# Altium schematic sheet Connectors.SchDoc
size A4; SheetNumber: 4; SheetTotal: 7
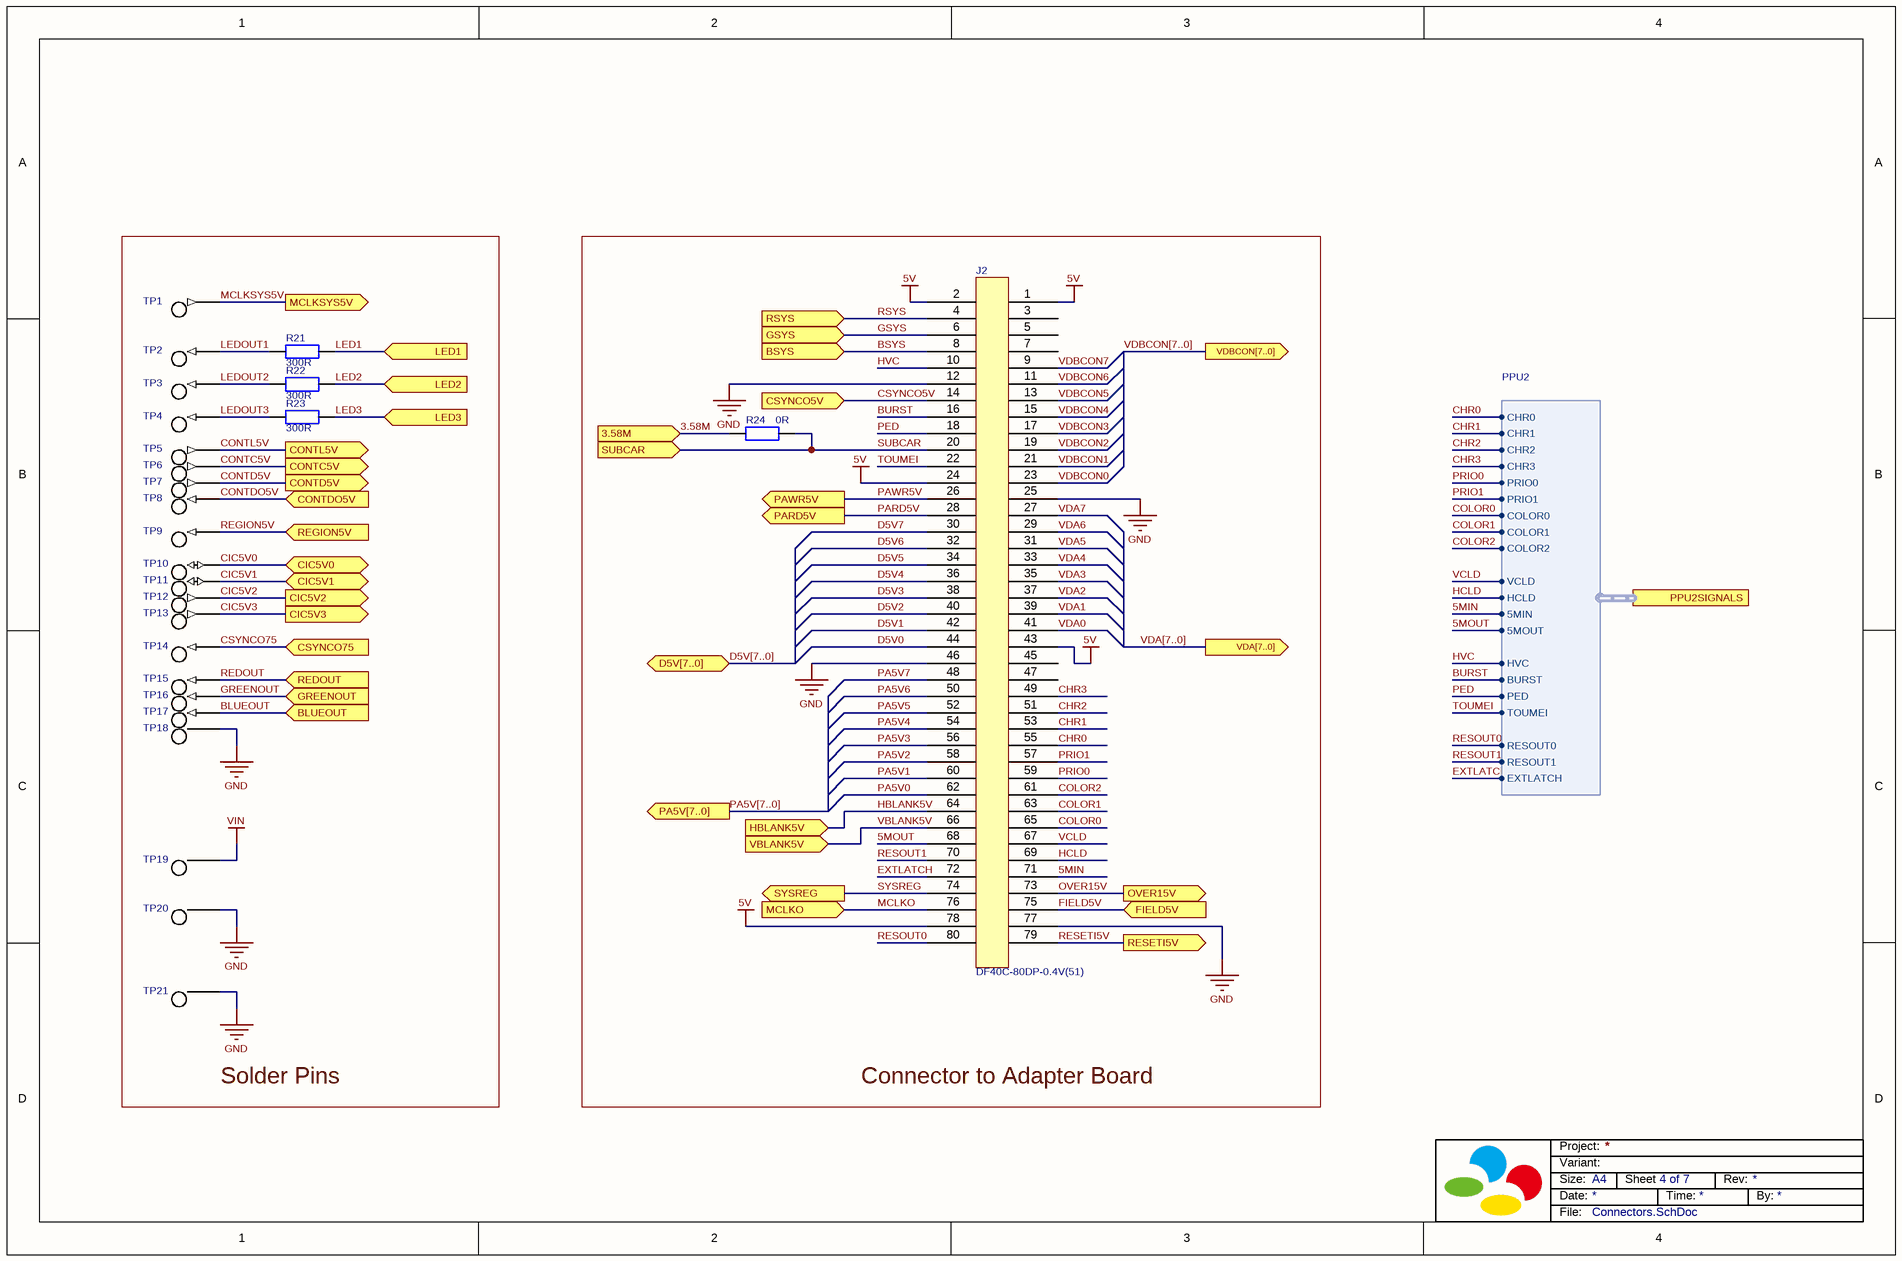
[diagram p0: Connectors.SchDoc]

## Parts
J2  Manufacturer_Part_Number: DF40C-80DP-0.4V(51)  [DF40C-80DP]  (hidden comment: DF40C-80DP)
R21  value 300R  [Res_0603_Chip]  (hidden comment: Resistor 300R 0603 ±1%)
R22  value 300R  [Res_0603_Chip]  (hidden comment: Resistor 300R 0603 ±1%)
R23  value 300R  [Res_0603_Chip]  (hidden comment: Resistor 300R 0603 ±1%)
R24  value 0R  [Res_0603_Chip]  (hidden comment: Resistor 0R 0603 ±1%)
TP1  Pin Connector  [Pin Connector Small]  (value not drawn)  (no BOM)
TP2  Pin Connector  [Pin Connector Small]  (value not drawn)  (no BOM)
TP3  Pin Connector  [Pin Connector Small]  (value not drawn)  (no BOM)
TP4  Pin Connector  [Pin Connector Small]  (value not drawn)  (no BOM)
TP5  Pin Connector  [Pin Connector Small]  (value not drawn)  (no BOM)
TP6  Pin Connector  [Pin Connector Small]  (value not drawn)  (no BOM)
TP7  Pin Connector  [Pin Connector Small]  (value not drawn)  (no BOM)
TP8  Pin Connector  [Pin Connector Small]  (value not drawn)  (no BOM)
TP9  Pin Connector  [Pin Connector Small]  (value not drawn)  (no BOM)
TP10  Pin Connector  [Pin Connector Small]  (value not drawn)  (no BOM)
TP11  Pin Connector  [Pin Connector Small]  (value not drawn)  (no BOM)
TP12  Pin Connector  [Pin Connector Small]  (value not drawn)  (no BOM)
TP13  Pin Connector  [Pin Connector Small]  (value not drawn)  (no BOM)
TP14  Pin Connector  [Pin Connector Small]  (value not drawn)  (no BOM)
TP15  Pin Connector  [Pin Connector Small]  (value not drawn)  (no BOM)
TP16  Pin Connector  [Pin Connector Small]  (value not drawn)  (no BOM)
TP17  Pin Connector  [Pin Connector Small]  (value not drawn)  (no BOM)
TP18  Pin Connector  [Pin Connector Small]  (value not drawn)  (no BOM)
TP19  Pin Connector  [Pin Connector Small]  (value not drawn)  (no BOM)
TP20  Pin Connector  [Pin Connector Small]  (value not drawn)  (no BOM)
TP21  Pin Connector  [Pin Connector Small]  (value not drawn)  (no BOM)

## Blocks framed on the sheet
Solder Pins: R21-R23 TP1-TP21
Connector to Adapter Board: J2 R24

## Ports
3.58M (in), BLUEOUT (in), BSYS (in), CIC5V0 (bidir), CIC5V1 (bidir), CIC5V2 (out), CIC5V3 (out), CONTC5V (out), CONTD5V (out), CONTDO5V (in), CONTL5V (out), CSYNCO5V (in), CSYNCO75 (in), D5V[7..0] (bidir), FIELD5V (in), GREENOUT (in), GSYS (in), HBLANK5V (in), LED1 (in), LED2 (in), LED3 (in), MCLKO (in), MCLKSYS5V (out), OVER15V (out), PA5V[7..0] (out), PARD5V (out), PAWR5V (out), PPU2SIGNALS (harness PPU2), REDOUT (in), REGION5V (in), RESETI5V (out), RSYS (in), SUBCAR (in), SYSREG (out), VBLANK5V (in), VDA[7..0] (out), VDBCON[7..0] (out)

## Harnesses
PPU2: CHR0, CHR1, CHR2, CHR3, PRIO0, PRIO1, COLOR0, COLOR1, COLOR2, VCLD, HCLD, 5MIN, 5MOUT, HVC, BURST, PED, TOUMEI, RESOUT0, RESOUT1, EXTLATCH

## Nets
5V: J2.1 J2.2 J2.24 J2.43 J2.78
GND: J2.12 J2.25 J2.46 J2.77 TP18.1 TP20.1 TP21.1
VIN: TP19.1
3.58M: R24.2 ; port 3.58M
5MIN: J2.71 ; port PPU2SIGNALS.5MIN
5MOUT: J2.68 ; port PPU2SIGNALS.5MOUT
BLUEOUT: TP17.1 ; port BLUEOUT
BSYS: J2.8 ; port BSYS
BURST: J2.16 ; port PPU2SIGNALS.BURST
CHR0: J2.55 ; port PPU2SIGNALS.CHR0
CHR1: J2.53 ; port PPU2SIGNALS.CHR1
CHR2: J2.51 ; port PPU2SIGNALS.CHR2
CHR3: J2.49 ; port PPU2SIGNALS.CHR3
CIC5V0: TP10.1 ; port CIC5V0
CIC5V1: TP11.1 ; port CIC5V1
CIC5V2: TP12.1 ; port CIC5V2
CIC5V3: TP13.1 ; port CIC5V3
COLOR0: J2.65 ; port PPU2SIGNALS.COLOR0
COLOR1: J2.63 ; port PPU2SIGNALS.COLOR1
COLOR2: J2.61 ; port PPU2SIGNALS.COLOR2
CONTC5V: TP6.1 ; port CONTC5V
CONTD5V: TP7.1 ; port CONTD5V
CONTDO5V: TP8.1 ; port CONTDO5V
CONTL5V: TP5.1 ; port CONTL5V
CSYNCO5V: J2.14 ; port CSYNCO5V
CSYNCO75: TP14.1 ; port CSYNCO75
D5V0: J2.44
D5V1: J2.42
D5V2: J2.40
D5V3: J2.38
D5V4: J2.36
D5V5: J2.34
D5V6: J2.32
D5V7: J2.30
EXTLATCH: J2.72 ; port PPU2SIGNALS.EXTLATCH
FIELD5V: J2.75 ; port FIELD5V
GREENOUT: TP16.1 ; port GREENOUT
GSYS: J2.6 ; port GSYS
HBLANK5V: J2.64 ; port HBLANK5V
HCLD: J2.69 ; port PPU2SIGNALS.HCLD
HVC: J2.10 ; port PPU2SIGNALS.HVC
LED1: R21.2 ; port LED1
LED2: R22.2 ; port LED2
LED3: R23.2 ; port LED3
LEDOUT1: R21.1 TP2.1
LEDOUT2: R22.1 TP3.1
LEDOUT3: R23.1 TP4.1
MCLKO: J2.76 ; port MCLKO
MCLKSYS5V: TP1.1 ; port MCLKSYS5V
OVER15V: J2.73 ; port OVER15V
PA5V0: J2.62
PA5V1: J2.60
PA5V2: J2.58
PA5V3: J2.56
PA5V4: J2.54
PA5V5: J2.52
PA5V6: J2.50
PA5V7: J2.48
PARD5V: J2.28 ; port PARD5V
PAWR5V: J2.26 ; port PAWR5V
PED: J2.18 ; port PPU2SIGNALS.PED
PRIO0: J2.59 ; port PPU2SIGNALS.PRIO0
PRIO1: J2.57 ; port PPU2SIGNALS.PRIO1
REDOUT: TP15.1 ; port REDOUT
REGION5V: TP9.1 ; port REGION5V
RESETI5V: J2.79 ; port RESETI5V
RESOUT0: J2.80 ; port PPU2SIGNALS.RESOUT0
RESOUT1: J2.70 ; port PPU2SIGNALS.RESOUT1
RSYS: J2.4 ; port RSYS
SUBCAR: J2.20 R24.1 ; port SUBCAR
SYSREG: J2.74 ; port SYSREG
TOUMEI: J2.22 ; port PPU2SIGNALS.TOUMEI
VBLANK5V: J2.66 ; port VBLANK5V
VCLD: J2.67 ; port PPU2SIGNALS.VCLD
VDA0: J2.41
VDA1: J2.39
VDA2: J2.37
VDA3: J2.35
VDA4: J2.33
VDA5: J2.31
VDA6: J2.29
VDA7: J2.27
VDBCON0: J2.23
VDBCON1: J2.21
VDBCON2: J2.19
VDBCON3: J2.17
VDBCON4: J2.15
VDBCON5: J2.13
VDBCON6: J2.11
VDBCON7: J2.9

Not connected (* = marked no-connect by the designer): J2 3 5 7 45 47

## Buses and harness runs
bus D5V[7..0] = port D5V[7..0]
bus PA5V[7..0] = port PA5V[7..0]
bus VDA[7..0] = port VDA[7..0]
bus VDBCON[7..0] = port VDBCON[7..0]

## Notes on the sheet
- Size:
- Date:
- Variant:
- Project:
- A4
- Sheet
- Time:
- Rev:
- By:
- File:

## Library data of the parts
J2 = Conn 80P: 80Pole Connector; Manufacturer: Hirose Connector
R21-R24 = R: ChipSize: 0603; Tolerance: ±1%; PartType: Resistor